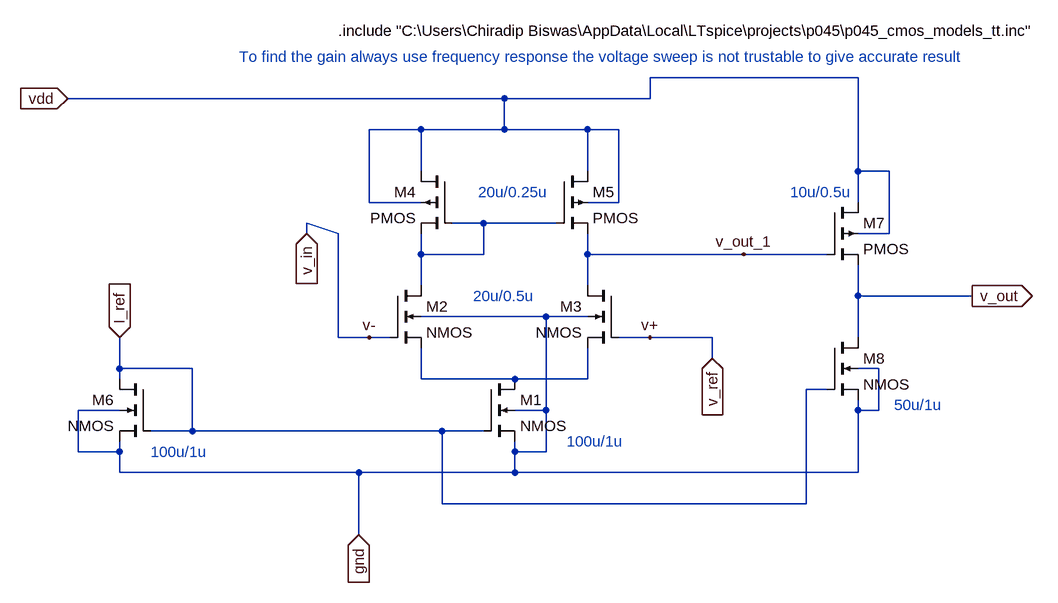
[diagram p0: schematic static_comparator_nmos_based_ckt.asc]
static_comparator_nmos_based_ckt.asc, the LTspice schematic file:
Version 4
SHEET 1 1336 680
WIRE 928 -144 608 -144
WIRE 384 -112 -288 -112
WIRE 608 -112 608 -144
WIRE 608 -112 384 -112
WIRE 256 -64 176 -64
WIRE 384 -64 384 -112
WIRE 384 -64 256 -64
WIRE 512 -64 384 -64
WIRE 560 -64 512 -64
WIRE 256 0 256 -64
WIRE 512 0 512 -64
WIRE 928 0 928 -144
WIRE 976 0 928 0
WIRE 176 48 176 -64
WIRE 256 48 176 48
WIRE 560 48 560 -64
WIRE 560 48 512 48
WIRE 928 48 928 0
WIRE 352 80 304 80
WIRE 464 80 352 80
WIRE 80 96 80 80
WIRE 128 96 80 80
WIRE 976 96 976 0
WIRE 976 96 928 96
WIRE 256 128 256 96
WIRE 352 128 352 80
WIRE 352 128 256 128
WIRE 512 128 512 96
WIRE 752 128 512 128
WIRE 880 128 752 128
WIRE 256 176 256 128
WIRE 512 176 512 128
WIRE 928 192 928 144
WIRE 1104 192 928 192
WIRE 448 224 256 224
WIRE 512 224 448 224
WIRE 128 256 128 96
WIRE 176 256 128 256
WIRE 208 256 176 256
WIRE 608 256 560 256
WIRE 704 256 608 256
WIRE 928 256 928 192
WIRE 704 288 704 256
WIRE -208 304 -208 256
WIRE -96 304 -208 304
WIRE 960 304 928 304
WIRE -208 320 -208 304
WIRE 256 320 256 272
WIRE 400 320 256 320
WIRE 512 320 512 272
WIRE 512 320 400 320
WIRE 880 336 848 336
WIRE -208 368 -272 368
WIRE 448 368 448 224
WIRE 448 368 400 368
WIRE 928 368 928 352
WIRE 960 368 960 304
WIRE 960 368 928 368
WIRE -96 400 -96 304
WIRE -96 400 -160 400
WIRE 288 400 -96 400
WIRE 352 400 288 400
WIRE -272 432 -272 368
WIRE -208 432 -208 416
WIRE -208 432 -272 432
WIRE 400 432 400 416
WIRE 448 432 448 368
WIRE 448 432 400 432
WIRE -208 464 -208 432
WIRE 160 464 -208 464
WIRE 400 464 400 432
WIRE 400 464 160 464
WIRE 928 464 928 368
WIRE 928 464 400 464
WIRE 288 512 288 400
WIRE 848 512 848 336
WIRE 848 512 288 512
WIRE 160 560 160 464
FLAG 608 256 v+
FLAG 176 256 v-
FLAG 752 128 v_out_1
FLAG 1104 192 v_out
IOPIN 1104 192 Out
FLAG 704 288 v_ref
IOPIN 704 288 In
FLAG 80 96 v_in
IOPIN 80 96 In
FLAG -288 -112 vdd
IOPIN -288 -112 In
FLAG -208 256 I_ref
IOPIN -208 256 In
FLAG 160 560 gnd
IOPIN 160 560 In
SYMBOL nmos4 352 320 R0
SYMATTR InstName M1
SYMATTR Value2 l=1u w=100u
SYMBOL nmos4 208 176 R0
SYMATTR InstName M2
SYMATTR Value2 l=0.5u w=20u
SYMBOL nmos4 560 176 M0
SYMATTR InstName M3
SYMATTR Value2 l=0.5u w=20u
SYMBOL pmos4 304 0 M0
SYMATTR InstName M4
SYMATTR Value2 l=0.25u w=20u
SYMBOL pmos4 464 0 R0
SYMATTR InstName M5
SYMATTR Value2 l=0.25u w=20u
SYMBOL nmos4 -160 320 M0
SYMATTR InstName M6
SYMATTR Value2 l=1u w=100u
SYMBOL pmos4 880 48 R0
SYMATTR InstName M7
SYMATTR Value2 l=0.5u w=10u
SYMBOL nmos4 880 256 R0
SYMATTR InstName M8
SYMATTR Value2 l=0.5u w=50u
TEXT 128 -216 Left 2 !.include "C:\\Users\\Chiradip Biswas\\AppData\\Local\\LTspice\\projects\\p045\\p045_cmos_models_tt.inc"
TEXT 480 416 Left 2 ;100u/1u
TEXT 344 32 Left 2 ;20u/0.25u
TEXT 336 192 Left 2 ;20u/0.5u
TEXT -160 432 Left 2 ;100u/1u
TEXT 824 32 Left 2 ;10u/0.5u
TEXT 984 360 Left 2 ;50u/1u
TEXT -24 -176 Left 2 ;To find the gain always use frequency response the voltage sweep is not trustable to give accurate result

The netlist it stands for:
* static_comparator_nmos_based_ckt.asc
M1 N002 I_ref gnd gnd NMOS l=1u w=100u
M2 N001 v_in N002 gnd NMOS l=0.5u w=20u
M3 v_out_1 v_ref N002 gnd NMOS l=0.5u w=20u
M4 vdd N001 N001 vdd PMOS l=0.25u w=20u
M5 vdd N001 v_out_1 vdd PMOS l=0.25u w=20u
M6 I_ref I_ref gnd gnd NMOS l=1u w=100u
M7 vdd v_out_1 v_out vdd PMOS l=0.5u w=10u
M8 v_out I_ref gnd gnd NMOS l=0.5u w=50u
.model NMOS NMOS
.model PMOS PMOS
.lib standard.mos
.include "C:\Users\Chiradip Biswas\AppData\Local\LTspice\projects\p045\p045_cmos_models_tt.inc"
* 100u/1u
* 20u/0.25u
* 20u/0.5u
* 100u/1u
* 10u/0.5u
* 50u/1u
* To find the gain always use frequency response the voltage sweep is not trustable to give accurate result
.backanno
.end